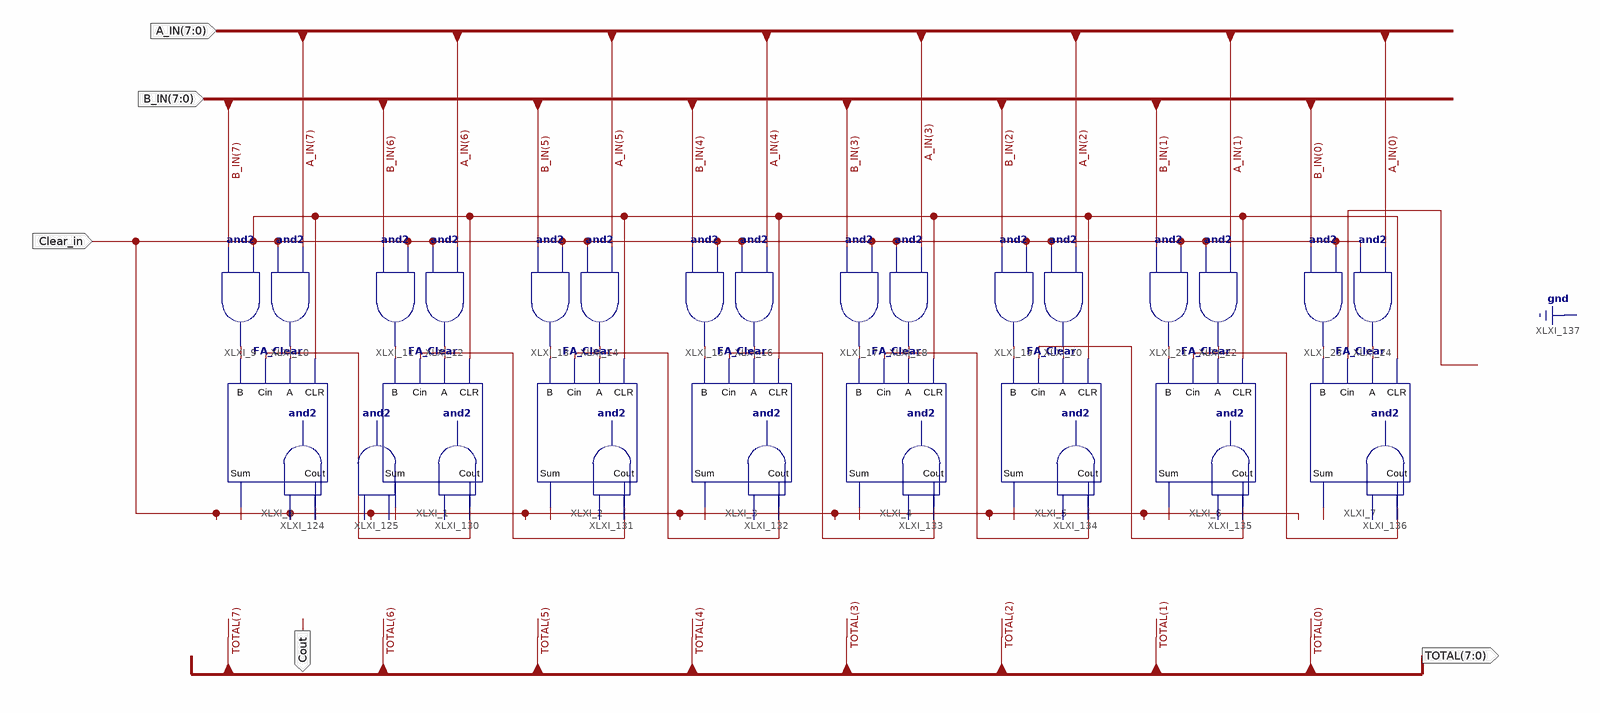
[diagram p0: schematic sheet 1]
// Xilinx ISE schematic ADDER_with_BUS.sch (artix7) as structural Verilog: 33 symbols, 5 ports
module ADDER_with_BUS (
  input  [7:0] A_IN,
  input  [7:0] B_IN,
  input  Clear_in,
  output [7:0] TOTAL,
  output Cout
);

  wire XLXN_3, XLXN_4, XLXN_5, XLXN_6, XLXN_7, XLXN_8, XLXN_9, XLXN_10, XLXN_11, XLXN_12, XLXN_13, XLXN_14,
       XLXN_15, XLXN_16, XLXN_17, XLXN_18, XLXN_312, XLXN_313, XLXN_314, XLXN_315, XLXN_316, XLXN_317,
       XLXN_318, XLXN_326, XLXN_327, XLXN_330, XLXN_331, XLXN_332, XLXN_333, XLXN_334, XLXN_335, XLXN_336;

  FA_Clear XLXI_2 (.CLR(Clear_in), .A(XLXN_8), .Cin(XLXN_314), .B(XLXN_7), .Cout(XLXN_313), .Sum(XLXN_331));
  FA_Clear XLXI_1 (.CLR(Clear_in), .A(XLXN_6), .Cin(XLXN_313), .B(XLXN_5), .Cout(XLXN_312), .Sum(XLXN_330));
  FA_Clear XLXI_4 (.CLR(Clear_in), .A(XLXN_12), .Cin(XLXN_316), .B(XLXN_11), .Cout(XLXN_315), .Sum(XLXN_333));
  FA_Clear XLXI_5 (.CLR(Clear_in), .A(XLXN_14), .Cin(XLXN_317), .B(XLXN_13), .Cout(XLXN_316), .Sum(XLXN_334));
  FA_Clear XLXI_6 (.CLR(Clear_in), .A(XLXN_16), .Cin(XLXN_318), .B(XLXN_15), .Cout(XLXN_317), .Sum(XLXN_335));
  FA_Clear XLXI_7 (.CLR(Clear_in), .A(XLXN_18), .Cin(1'b0), .B(XLXN_17), .Cout(XLXN_318), .Sum(XLXN_336));
  FA_Clear XLXI_8 (.CLR(Clear_in), .A(XLXN_4), .Cin(XLXN_312), .B(XLXN_3), .Cout(XLXN_327), .Sum(XLXN_326));
  and XLXI_9 (XLXN_3, B_IN[7], Clear_in);
  and XLXI_10 (XLXN_4, Clear_in, A_IN[7]);
  and XLXI_11 (XLXN_5, B_IN[6], Clear_in);
  and XLXI_12 (XLXN_6, Clear_in, A_IN[6]);
  and XLXI_13 (XLXN_7, B_IN[5], Clear_in);
  and XLXI_14 (XLXN_8, Clear_in, A_IN[5]);
  and XLXI_15 (XLXN_9, B_IN[4], Clear_in);
  and XLXI_16 (XLXN_10, Clear_in, A_IN[4]);
  and XLXI_17 (XLXN_11, B_IN[3], Clear_in);
  and XLXI_18 (XLXN_12, Clear_in, A_IN[3]);
  and XLXI_19 (XLXN_13, B_IN[2], Clear_in);
  and XLXI_20 (XLXN_14, Clear_in, A_IN[2]);
  and XLXI_21 (XLXN_15, B_IN[1], Clear_in);
  and XLXI_22 (XLXN_16, Clear_in, A_IN[1]);
  and XLXI_23 (XLXN_17, B_IN[0], Clear_in);
  and XLXI_24 (XLXN_18, Clear_in, A_IN[0]);
  and XLXI_124 (TOTAL[7], XLXN_326, Clear_in);
  and XLXI_125 (Cout, XLXN_327, Clear_in);
  FA_Clear XLXI_3 (.CLR(Clear_in), .A(XLXN_10), .Cin(XLXN_315), .B(XLXN_9), .Cout(XLXN_314), .Sum(XLXN_332));
  and XLXI_130 (TOTAL[6], XLXN_330, Clear_in);
  and XLXI_131 (TOTAL[5], XLXN_331, Clear_in);
  and XLXI_132 (TOTAL[4], XLXN_332, Clear_in);
  and XLXI_133 (TOTAL[3], XLXN_333, Clear_in);
  and XLXI_134 (TOTAL[2], XLXN_334, Clear_in);
  and XLXI_135 (TOTAL[1], XLXN_335, Clear_in);
  and XLXI_136 (TOTAL[0], XLXN_336, Clear_in);
endmodule
